# EasyEDA Pro project JLCEDA_AT-START-F490 V1.0.epro, schematic AT-START-F490 V1.0

## Sheets
1 AT_Link_EZ: Board Name: AT-START-F490 V1.0; Create Date: 2024-11-26; Page Name: AT_Link_EZ; Project Name: AT-START-F490; Schematic Name: AT-START-F490; Update Date: 2024-11-26; Company: Artery Technology; Drawed: SD; Page Size: A4; Version: 1.4
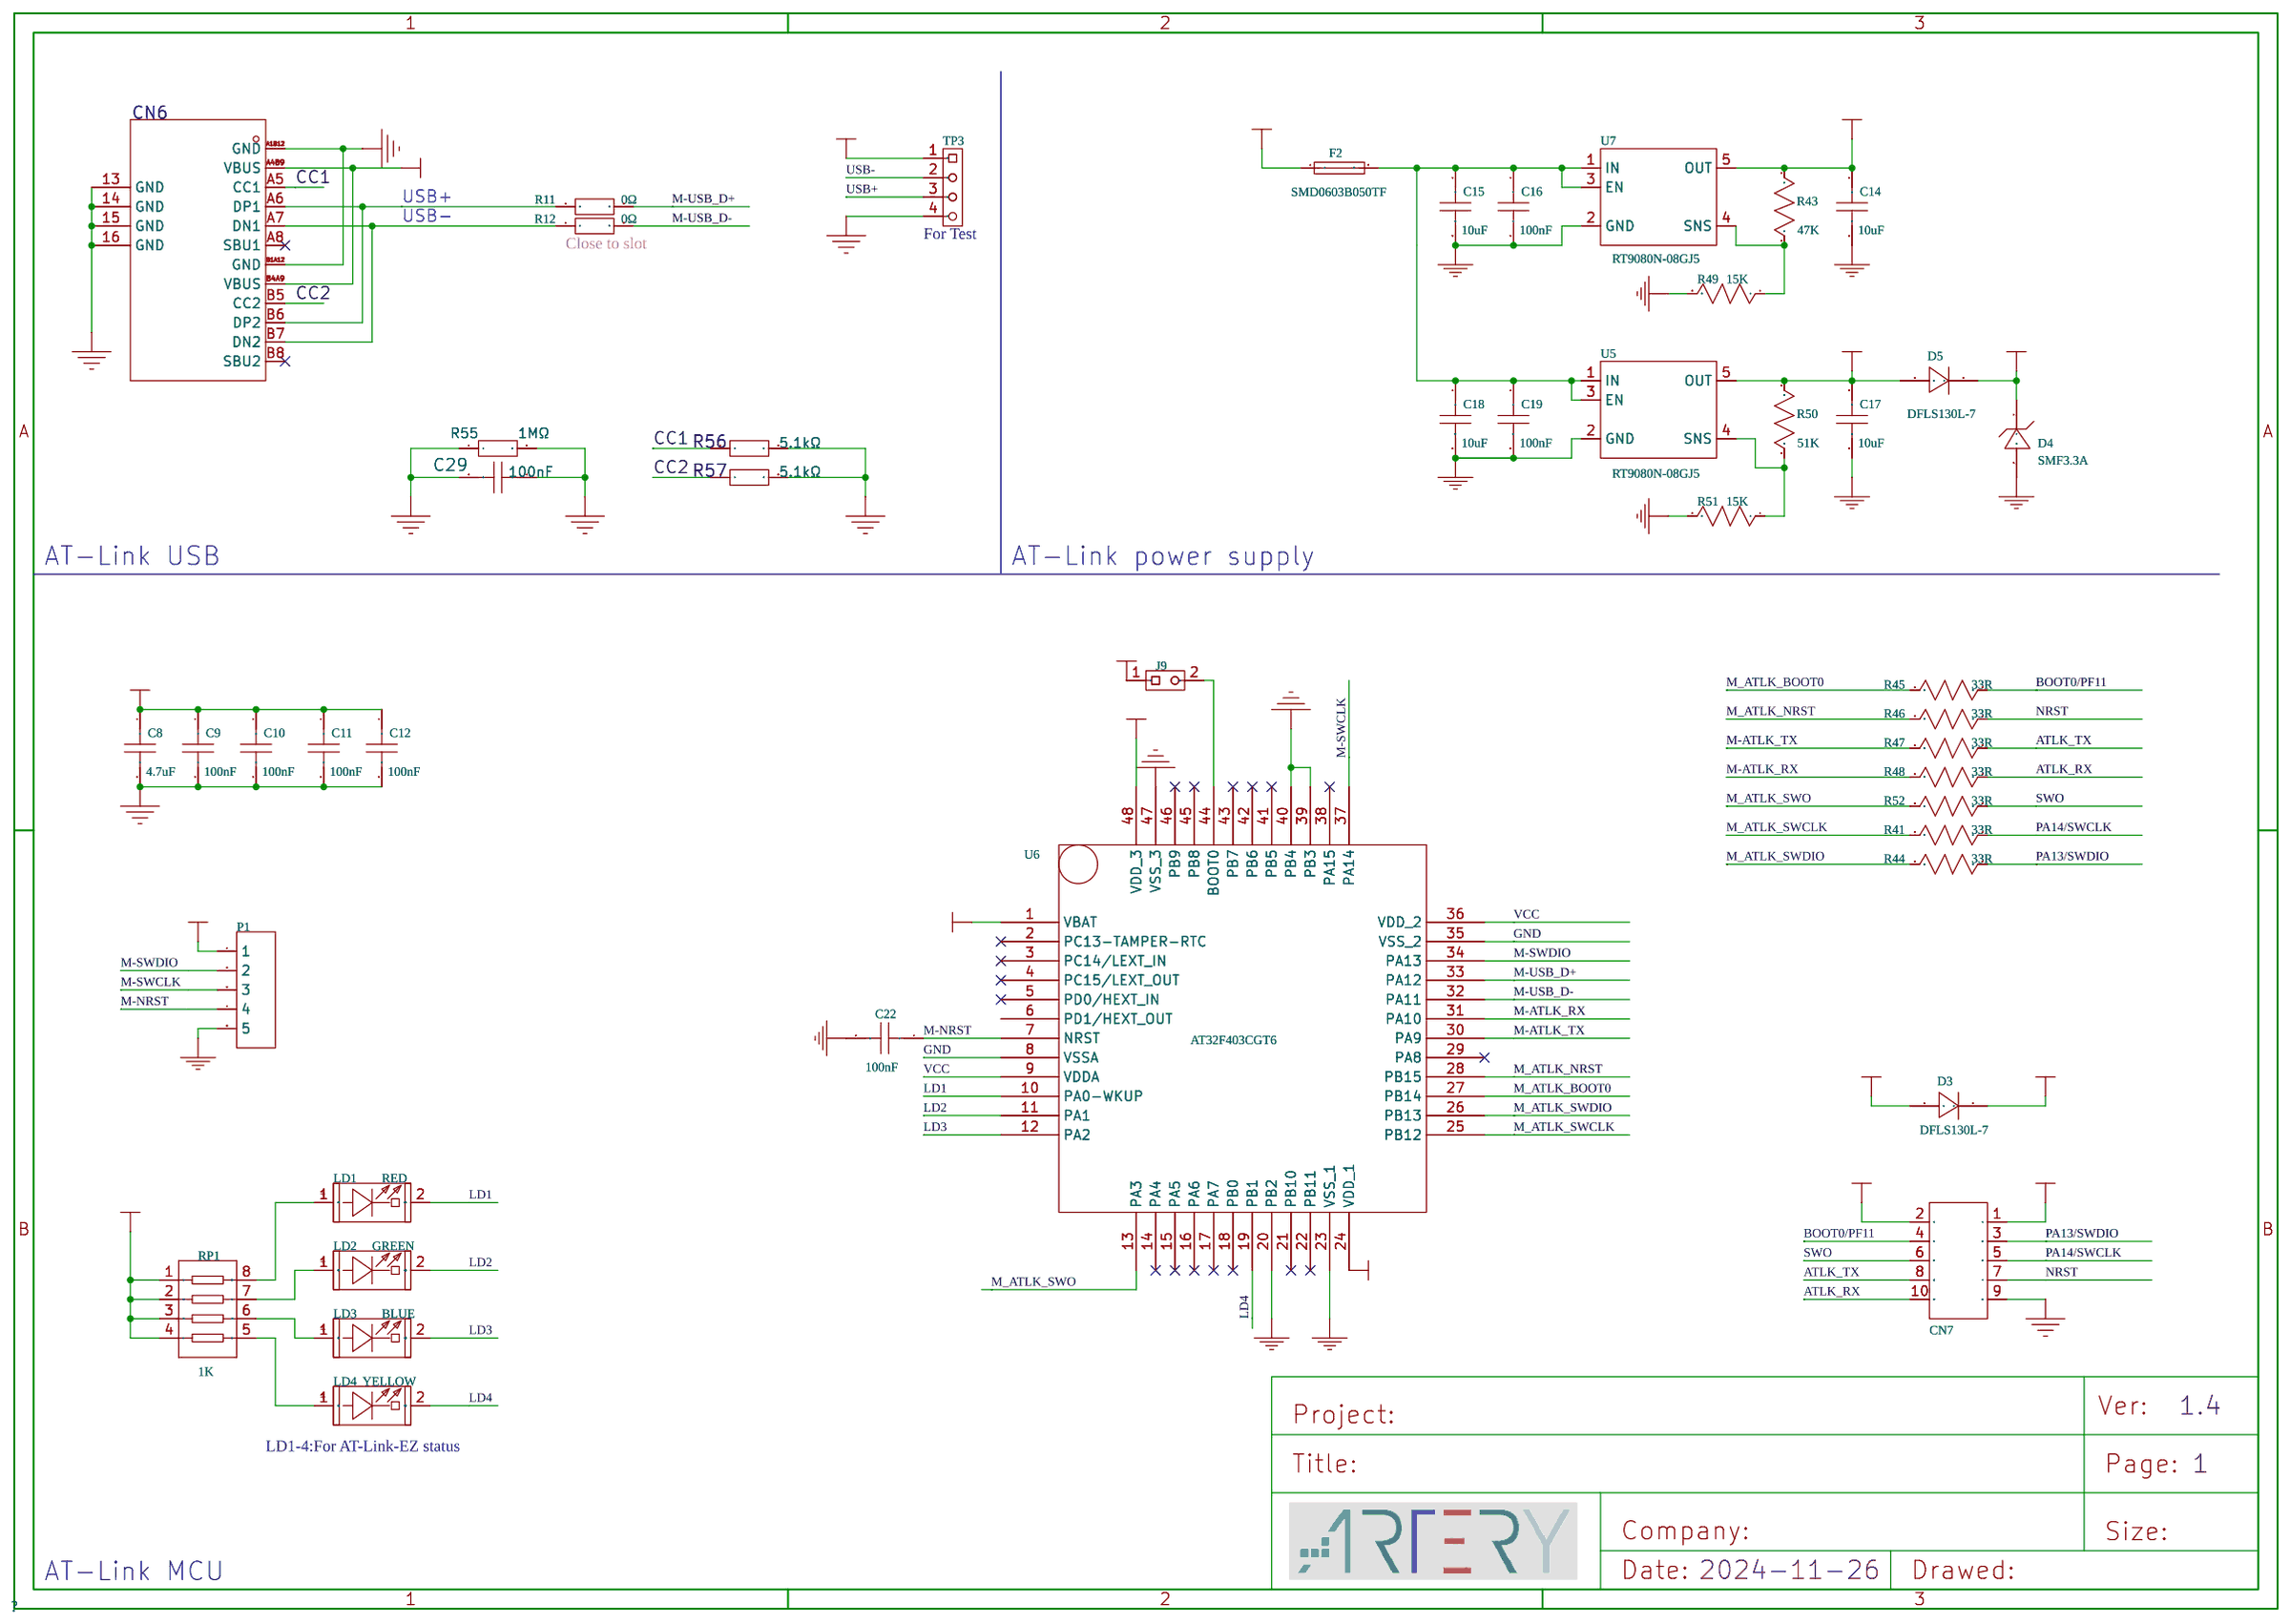
[diagram p0: AT_Link_EZ]
2 Power & Peripherals: Page Name: Power & Peripherals; Version: 1.0
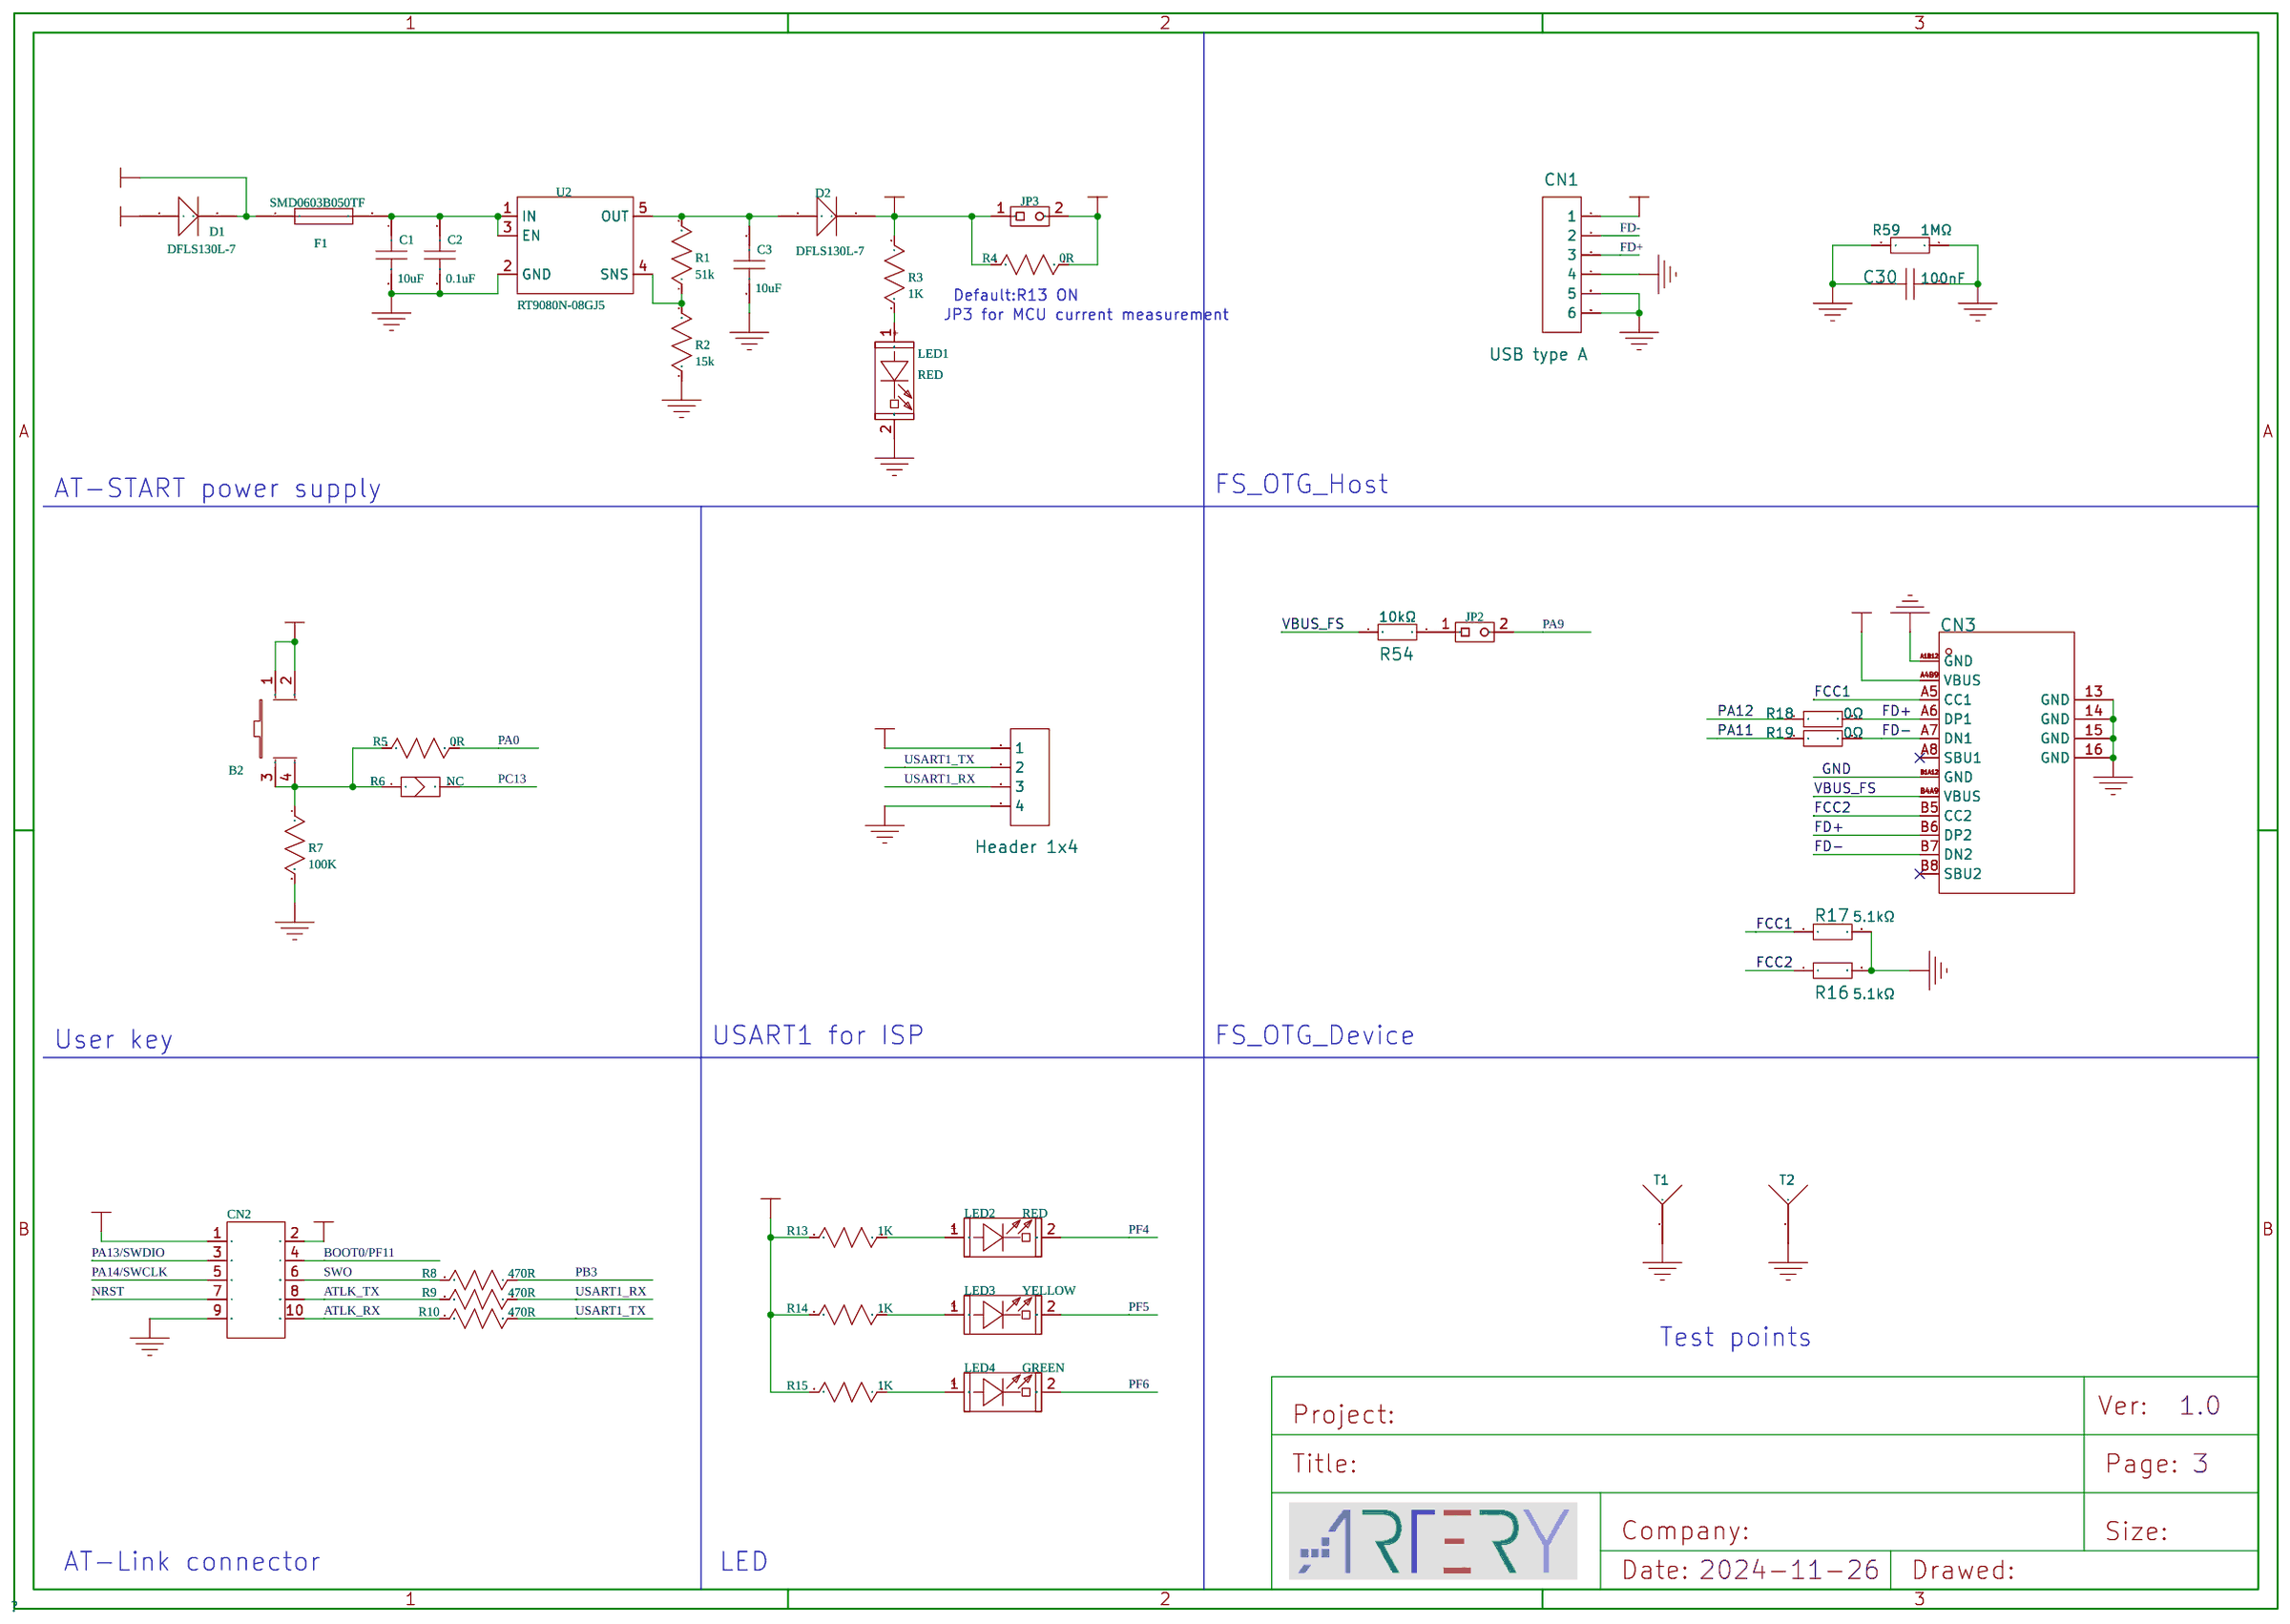
[diagram p1: Power & Peripherals]
3 Connectors: Page Name: Connectors; Version: 1.0
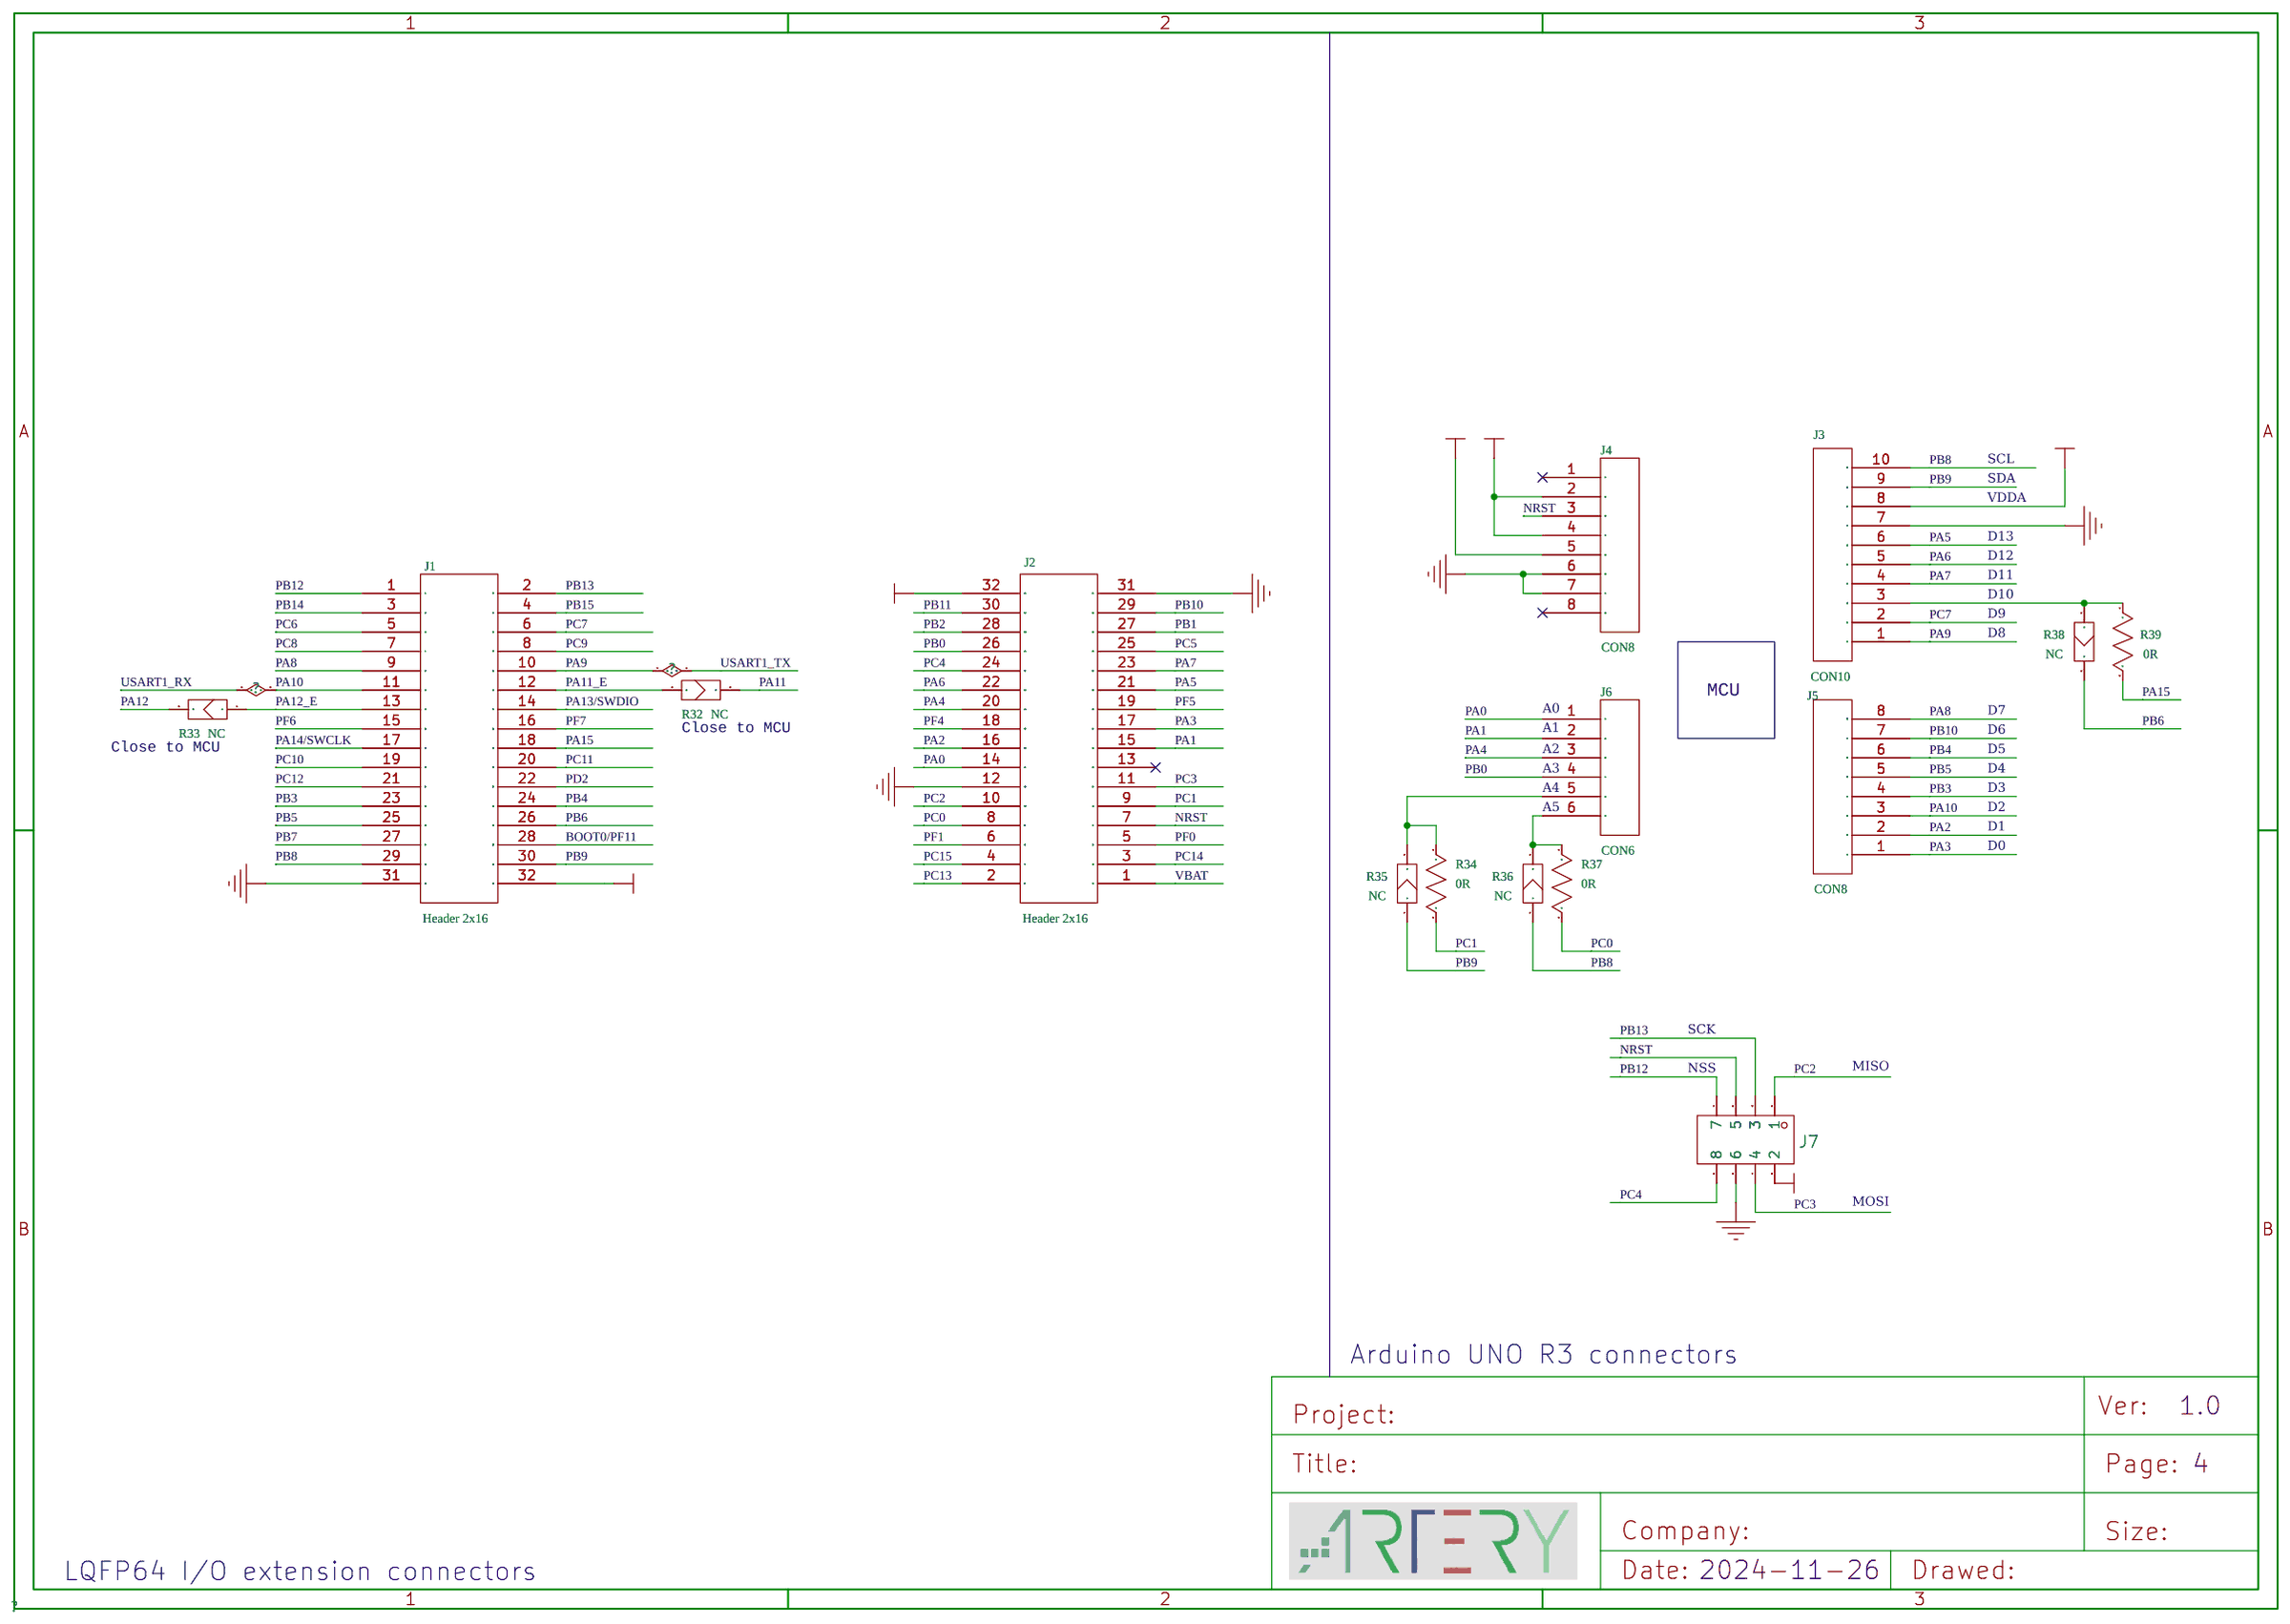
[diagram p2: Connectors]
4 MCU: Page Name: MCU; Version: 1.0
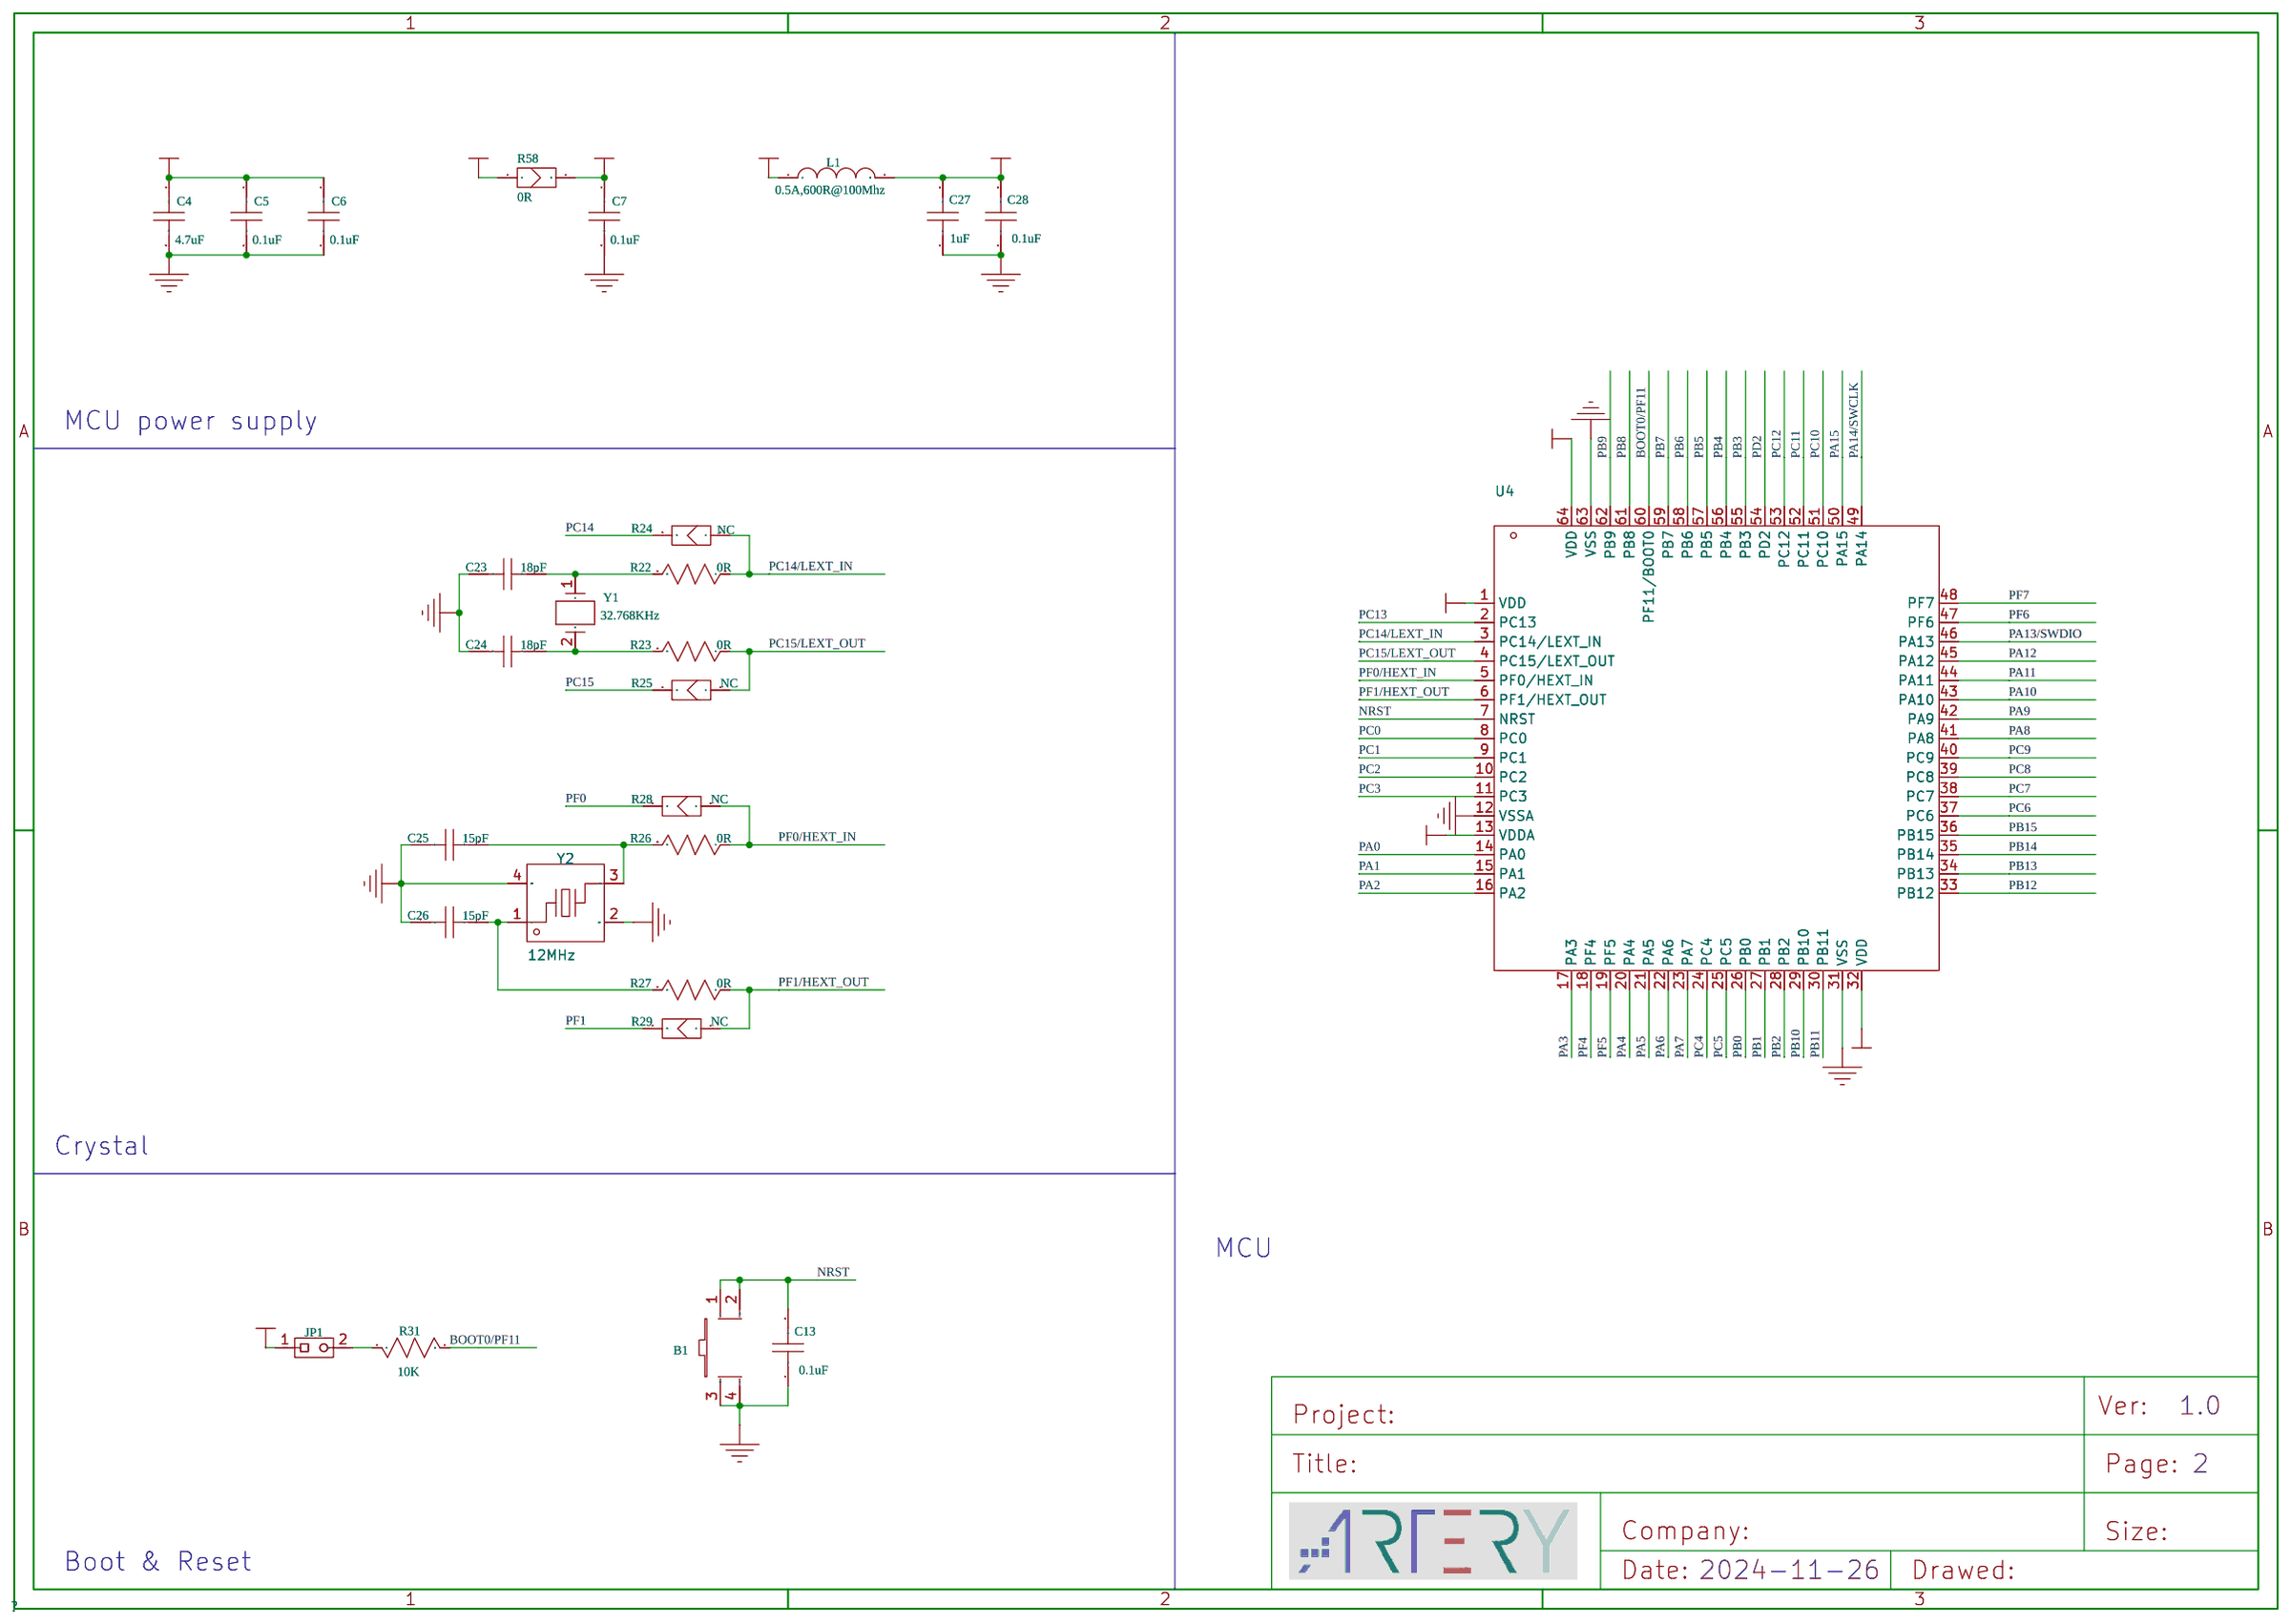
[diagram p3: MCU]

## Parts
sheet AT_Link_EZ
C8  4.7uF  [C0603]
C9  100nF  [C0603]
C10  100nF  [C0603]
C11  100nF  [C0603]
C12  100nF  [C0603]
C14  10uF  [C0603]
C15  10uF  [C0603]
C16  100nF  [C0603]
C17  10uF  [C0603]
C18  10uF  [C0603]
C19  100nF  [C0603]
C22  100nF  [C0603]
C29  100nF  [C0603]
CN6  -  [USB-C-SMD_TYPEC-304-BCP16]
CN7  CON1  [HDR2X5]
D3  DFLS130L-7  [POWERDI-123_L2.8-W1.8-LS3.7-RD]
D4  SMF3.3A  [SOD-123_L2.8-W1.8-LS3.7-RD]
D5  DFLS130L-7  [POWERDI-123_L2.8-W1.8-LS3.7-RD]
F2  SMD0603B050TF  [R0603]
J9  1X2P,Male,DIP_2.54  [HDR1X2]
LD1  RED  [LED0603]
LD2  GREEN  [LED0603]
LD3  BLUE  [LED0603]
LD4  YELLOW  [LED0603]
P1  HDR-M-2.54_1x5  [HDR-M-2.54_1X5]
R11  0Ω  [R0603]
R12  0Ω  [R0603]
R41  33R  [0603_R-M]
R43  47K  [0603_R-M]
R44  33R  [0603_R-M]
R45  33R  [0603_R-M]
R46  33R  [0603_R-M]
R47  33R  [0603_R-M]
R48  33R  [0603_R-M]
R49  15K  [0603_R-M]
R50  51K  [0603_R-M]
R51  15K  [0603_R-M]
R52  33R  [0603_R-M]
R55  1MΩ  [R0603]
R56  5.1kΩ  [R0603]
R57  5.1kΩ  [R0603]
RP1  1K  [0603*4,8P4R]
TP3  1X4P_2.54F  [HDR1X4 - TOP]
U5  RT9080N-08GJ5  [SOT-23-5]
U6  AT32F403CGT6  [LQFP48 - 2]
U7  RT9080N-08GJ5  [SOT-23-5]
sheet Connectors
J1  Header 2x16  [HDR-M-2.54_2X16]
J2  Header 2x16  [HDR-M-2.54_2X16]
J3  CON10  [FEMALE HEADER 1X10]
J4  CON8  [FEMALE HEADER 1X8]
J5  CON8  [FEMALE HEADER 1X8]
J6  CON6  [FEMALE HEADER 1X6]
J7  Header 4X2  [HDR2X4]
R32  NC  [SB-PAD]
R33  NC  [SB-PAD]
R34  0R  [SB-PAD]
R35  NC  [SB-PAD]
R36  NC  [SB-PAD]
R37  0R  [SB-PAD]
R38  NC  [SB-PAD]
R39  0R  [SB-PAD]
sheet MCU
B1  BUTTON_SMT,6.0x6.0x4.5mm  [BUTTON_SMT_6*6*5]
C4  4.7uF  [0603_C-M]
C5  0.1uF  [0603_C-M]
C6  0.1uF  [0603_C-M]
C7  0.1uF  [0603_C-M]
C13  0.1uF  [0603_C-M]
C23  18pF  [0603_C-M]
C24  18pF  [0603_C-M]
C25  15pF  [0603_C-M]
C26  15pF  [0603_C-M]
C27  1uF  [0603_C-M]
C28  0.1uF  [0603_C-M]
JP1  NC(Header 1x2)  [HEADER 1X2]
L1  0.5A,600R@100Mhz  [0603_L]
R22  0R  [0603_R-M]
R23  0R  [0603_R-M]
R24  NC  [SB-PAD]
R25  NC  [SB-PAD]
R26  0R  [0603_R-M]
R27  0R  [0603_R-M]
R28  NC  [SB-PAD]
R29  NC  [SB-PAD]
R31  10K  [0603_R-M]
R58  0R  [SB-PAD]
U4  -  [lqfp-64_l10.0-w10.0-p0.50-ls12.0-bl]
Y1  32.768KHz  [XTAL_SOP - FC-12M]
Y2  12MHz  [CRYSTAL-SMD_4P-L3.2-W2.5-BL]
sheet Power & Peripherals
B2  BUTTON_SMT,6.0x6.0x4.5mm  [BUTTON_SMT_6*6*5]
C1  10uF  [0603_C-M]
C2  0.1uF  [0603_C-M]
C3  10uF  [0603_C-M]
C30  100nF  [C0603]
CN1  USB type A  [USB-A-TH__USB-AF-90]
CN2  NC(Header 2x5)  [HDR2X5]
CN3  -  [USB-C-SMD_TYPEC-304-BCP16]
D1  DFLS130L-7  [SOD-123]
D2  DFLS130L-7  [SOD-123]
F1  SMD0603B050TF  [R0603]
J8  Header 1x4  [HDR1X4]
JP2  NC(Header 1x2)  [HEADER 1X2]
JP3  NC(Header 1x2)  [HEADER 1X2]
LED1  RED  [LED0603]
LED2  RED  [LED0603]
LED3  YELLOW  [LED0603]
LED4  GREEN  [LED0603]
R1  51k  [0603_R-M]
R2  15k  [0603_R-M]
R3  1K  [0603_R-M]
R4  0R  [0603_R-M]
R5  0R  [0603_R-M]
R6  NC  [SB-PAD]
R7  100K  [0603_R-M]
R8  470R  [0603_R-M]
R9  470R  [0603_R-M]
R10  470R  [0603_R-M]
R13  1K  [0603_R-M]
R14  1K  [0603_R-M]
R15  1K  [0603_R-M]
R16  5.1kΩ  [R0603]
R17  5.1kΩ  [R0603]
R18  0Ω  [R0603]
R19  0Ω  [R0603]
R54  10kΩ  [R0603]
R59  1MΩ  [R0603]
T1  Testpoint  [TESTHOOK]
T2  Testpoint  [TESTHOOK]
U2  RT9080N-08GJ5  [SOT-23-5]

## Library data of the parts
C4 C8 = 4.7uF
C9-C12 C16 C19 C22 = CC0603KRX7R9BB104: 容值:100nF;精度:±10%;额定电压:50V;材质(温度系数):X7R;; LCSC Part Name: 100nF ±10% 50V; Supplier Part: C14663; Manufacturer: YAGEO(国巨); Supplier Footprint: 0603; JLCPCB Part Class: Basic Part; Datasheet: https://atta.szlcsc.com/upload/public/pdf/source/20180910/C282072_33301C7F631E79921B82A8DAC6BCC5B3.pdf; Supplier: LCSC; Tolerance: ±10%; Voltage Rated: 50V; Temperature Coefficient: X7R
C14 C15 C17 C18 = CL10A106KP8NNNC: 容值:10uF;精度:±10%;额定电压:10V;材质(温度系数):X5R;; LCSC Part Name: 10uF ±10% 10V; Supplier Part: C19702; Manufacturer: SAMSUNG(三星); Supplier Footprint: 0603; JLCPCB Part Class: Basic Part; Datasheet: https://atta.szlcsc.com/upload/public/pdf/source/20160103/1457707703378.pdf; Supplier: LCSC; Tolerance: ±10%; Voltage Rated: 10V; Temperature Coefficient: X5R
C29 C30 = CC0603KRX7R9BB104: 容值:100nF;精度:±10%;额定电压:50V;温度系数:X7R;; LCSC Part Name: 100nF ±10% 50V; Supplier Part: C14663; Manufacturer: YAGEO(国巨); Supplier Footprint: 0603; JLCPCB Part Class: Basic Part; Datasheet: https://atta.szlcsc.com/upload/public/pdf/source/20170116/1484561234239.pdf; Supplier: LCSC; Tolerance: ±10%; Voltage Rated: 50V; Temperature Coefficient: X7R
CN3 CN6 = TYPEC-304-BCP16: 连接器类型:Type-C;标准:USB 3.1;公母:母座;触点数量:16.0;端口数量:1;安装方式:卧贴;额定电流 - 电源:3A;工作温度范围:-25~+85;焊接温度(最大值):260;; Supplier Part: C720629; Manufacturer: XUNPU(讯普); Supplier Footprint: SMD; JLCPCB Part Class: Extended Part; Datasheet: https://atta.szlcsc.com/upload/public/pdf/source/20211022/DACD6552F639E9483017DE6DC0E61150.pdf; Supplier: LCSC; Connector Type: Type-C; Standard: USB 3.1; Gender: 母座; Number of Contacts: 16.0; Number of Ports: 1; Mounting Sytle: 卧贴; Current Rating - Power (Max): 3A; Operating Temperature Range: -25~+85; Welding Temperature (Max): 260
CN7 = CON1
D3 D5 = DFLS130L-7: Supplier: LCSC; Supplier Part: C110493; Manufacturer: Diodes Incorporated; Paste Type: expand
D4 = SMF3.3A: Supplier: LCSC; Supplier Part: C283866; Manufacturer: DOWO; Paste Type: expand
F2 = SMD0603B035TF: Supplier: LCSC; Supplier Part: C269154; Manufacturer: Brightking Elec (TAIWAN); Paste Type: expand
J9 = 1X2P,Male,DIP_2.54
LD1 LED1 LED2 = RED
LD2 LED4 = GREEN
LD3 = BLUE
LD4 LED3 = YELLOW
P1 = HDR-M-2.54_1x5: Supplier Part: C358687; Supplier: LCSC
R11 R12 = 0603WAF0000T5E: 电阻类型:厚膜电阻;阻值:0Ω;精度:±1%;功率:100mW;; LCSC Part Name: 0Ω ±1% 100mW; Supplier Part: C21189; Manufacturer: UNI-ROYAL(厚声); Supplier Footprint: 0603; JLCPCB Part Class: Basic Part; Datasheet: https://atta.szlcsc.com/upload/public/pdf/source/20200306/C422600_1E6D84923E4A46A82E41ADD87F860B5C.pdf; Supplier: LCSC; Type: 厚膜电阻; Tolerance: ±1%; Power(Watts): 100mW; Overload Voltage (Max): 75V; Operating Temperature Range: -55℃~+155℃
R41 R44-R48 R52 = 33R
R43 = 47K
R49 R51 = 15K
R50 = 51K
R55 R59 = RC0603FR-071ML: 阻值:1MΩ;精度:±1%;功率:100mW;温度系数:±100ppm/;最大工作电压:75V;工作温度范围:-55~+155;; LCSC Part Name: 1MΩ ±1%; Supplier Part: C105578; Manufacturer: YAGEO(国巨); Supplier Footprint: 0603; JLCPCB Part Class: Extended Part; Datasheet: https://atta.szlcsc.com/upload/public/pdf/source/20181102/C105578_67A9388250AF143DE4682E62257D2969.pdf; Supplier: LCSC; Tolerance: ±1%; Power(Watts): 100mW; Temperature Coefficient: ±100ppm/; Overload Voltage (Max): 75V; Operating Temperature Range: -55~+155
R16 R17 R56 R57 = 0603WAF5101T5E: 电阻类型:厚膜电阻;阻值:5.1kΩ;精度:±1%;功率:1/10W;温度系数:±100ppm/;最大工作电压:75V;工作温度范围:-55~+155;; LCSC Part Name: 5.1kΩ ±1%; Supplier Part: C23186; Manufacturer: UNI-ROYAL(厚声); Supplier Footprint: 0603; JLCPCB Part Class: Basic Part; Datasheet: https://atta.szlcsc.com/upload/public/pdf/source/20200306/C422600_1E6D84923E4A46A82E41ADD87F860B5C.pdf; Supplier: LCSC; Type: 厚膜电阻; Tolerance: ±1%; Power(Watts): 1/10W; Temperature Coefficient: ±100ppm/; Overload Voltage (Max): 75V; Operating Temperature Range: -55~+155
RP1 = 1K: Comment: 33R
TP3 = 1X4P_2.54F
U2 U5 U7 = RT9080N-08GJ5
U6 = AT32F403CGT6
J1 J2 = Header 2x16
J3 = CON10
J4 J5 = CON8
J6 = CON6
J7 = Header 4X2: LatestRevisionDate: 17-Jul-2002; LatestRevisionNote: Re-released for DXP Platform.; Publisher: Altium Limited
R6 R24 R25 R28 R29 R32 R33 R35 R36 R38 R58 = NC
R4 R5 R22 R23 R26 R27 R34 R37 R39 = 0R
B1 B2 = BUTTON_SMT,6.0x6.0x4.5mm
C2 C5-C7 C13 C28 = 0.1uF
C23 C24 = 10pF
C25 C26 = 22pF
C27 = 1uF
JP1-JP3 = NC(Header 1x2)
L1 = 0.5A,600R@100Mhz
R31 = 10K
U4 = AT32F490RxT7: 由官方提供; Manufacturer: Artery Technology
Y1 = 32.768KHz
Y2 = CJ13-120001210B20: 频率:12MHz;负载电容:12pF;; LCSC Part Name: 12MHz 12pF; Supplier Part: C2875246; Manufacturer: CJ(江苏长电/长晶); Supplier Footprint: SMD3225-4P; JLCPCB Part Class: 扩展库; Datasheet: https://atta.szlcsc.com/upload/public/pdf/source/20210824/E6873A29EC9F0F4D38BC5C84A85B05C9.pdf; Supplier: LCSC; Load Capacitance: 12pF
C1 C3 = 10uF
CN1 = USB type A: Supplier Part: C40877; Supplier: LCSC
CN2 = NC(Header 2x5)
D1 D2 = DFLS130L-7: Published: 8-Jun-2000; LatestRevisionDate: 17-Jul-2002; LatestRevisionNote: Re-released for DXP Platform.; PackageVersion: Sep-1996; PackageReference: SMC; Publisher: Altium Limited; PackageDescription: DO-214-AB/SMC; 2 C-Bend Leads; Body 7.9 x 5.9 mm, inc. leads (LxW); Code_JEDEC: DO-214-AB
F1 = SMD0603B050TF: Published: 8-Jun-2000; LatestRevisionDate: 17-Jul-2002; LatestRevisionNote: Re-released for DXP Platform.; PackageReference: PIN-W2/E2.8; Publisher: Altium Limited; PackageDescription: Thru-Hole; 2 Leads
J8 = Header 1x4: Supplier Part: C124378; Supplier: LCSC
R1 = 51k
R2 = 15k
R3 R13-R15 = 1K
R7 = 100K
R8-R10 = 470R
R18 R19 = 0603WAF220JT5E: 电阻类型:厚膜电阻;阻值:22Ω;精度:±1%;功率:100mW;温度系数:±100ppm/;最大工作电压:75V;工作温度范围:-55~+155;; LCSC Part Name: 22Ω ±1% 100mW; Supplier Part: C23345; Manufacturer: UNI-ROYAL(厚声); Supplier Footprint: 0603; JLCPCB Part Class: 基础库; Datasheet: https://atta.szlcsc.com/upload/public/pdf/source/20200306/C422600_1E6D84923E4A46A82E41ADD87F860B5C.pdf; Supplier: LCSC; Type: 厚膜电阻; Tolerance: ±1%; Power(Watts): 100mW; Temperature Coefficient: ±100ppm/; Overload Voltage (Max): 75V; Operating Temperature Range: -55~+155
R54 = 0603WAF1002T5E: 电阻类型:厚膜电阻;阻值:10kΩ;精度:±1%;功率:1/10W;温度系数:±100ppm/;最大工作电压:75V;工作温度范围:-55~+155;; LCSC Part Name: 10kΩ ±1%; Supplier Part: C25804; Manufacturer: UNI-ROYAL(厚声); Supplier Footprint: 0603; JLCPCB Part Class: Basic Part; Datasheet: https://atta.szlcsc.com/upload/public/pdf/source/20200306/C422600_1E6D84923E4A46A82E41ADD87F860B5C.pdf; Supplier: LCSC; Type: 厚膜电阻; Tolerance: ±1%; Power(Watts): 1/10W; Temperature Coefficient: ±100ppm/; Overload Voltage (Max): 75V; Operating Temperature Range: -55~+155
T1 T2 = Testpoint: LatestRevisionDate: 17-Jul-2002; LatestRevisionNote: Re-released for DXP Platform.; Publisher: Altium Limited

## Nets
3V3: CN2.1 CN7.1 D2.2(K) D4.1 D5.1 J4.2 J4.4 J8.1 JP3.1 R3.1 R4.2 R13.2 R14.2 R15.2
5V: CN1.1 CN2.2 CN7.2 D1.2(K) D3.1 F1.1 J4.5 J7.2
GND: B1.3 B1.4 C1.2 C2.2 C3.2 C4.2 C5.2 C6.2 C7.2 C8.2 C9.2 C10.2 C11.2 C12.2 C13.1 C14.2 C15.2 C16.2 C17.2 C18.2 C19.2 C22.2 C23.1 C24.1 C25.1 C26.1 C27.1 C28.1 C29.1 C30.1 CN1.4 CN2.9 CN3.A1B12(GND) CN3.B1A12(GND) CN6.A1B12(GND) CN6.B1A12(GND) CN7.9 D4.2 J1.31 J2.12 J2.31 J3.7 J4.6 J4.7 J7.6 J8.4 LED1.2(CATHODE) P1.5 R2.1 R7.2 R16.2 R17.2 R49.2 R51.2 R55.2 R56.2 R57.2 R59.2 T1.1 T2.1 TP3.4 U2.2(GND) U4.12(VSSA) U4.31(VSS) U4.63(VSS) U5.2(GND) U6.8(VSSA) U6.20(PB2) U6.23(VSS_1) U6.35(VSS_2) U6.39(PB3) U6.40(PB4) U6.47(VSS_3) U7.2(GND) Y2.2(GND) Y2.4(GND)
VBAT: J2.1
VBUS_FS: CN3.A4B9(VBUS) CN3.B4A9(VBUS) D1.1(A) R54.2
VCC: C8.1 C9.1 C10.1 C11.1 C12.1 C14.1 J9.1 P1.1 R43.2 RP1.1 RP1.2 RP1.3 RP1.4 U6.1(VBAT) U6.9(VDDA) U6.24(VDD_1) U6.36(VDD_2) U6.48(VDD_3) U7.5(OUT)
VCC3.5V: C17.1 D5.2 R50.2 U5.5(OUT)
VDD: B2.1 B2.2 C4.1 C5.1 C6.1 C7.1 J1.32 J2.32 JP1.1 JP3.2 L1.1 R4.1 R58.1 R58.2 U4.1(VDD) U4.32(VDD) U4.64(VDD)
VDDA: C27.2 C28.2 J3.8 L1.2 U4.13(VDDA)
ATLINK_5V: CN6.A4B9(VBUS) CN6.B4A9(VBUS) D3.2 F2.1 TP3.1
ATLK_RX: CN2.10 CN7.10 R10.2 R48.1
ATLK_TX: CN2.8 CN7.8 R9.2 R47.1
BOOT0/PF11: CN2.4 CN7.4 J1.28 R31.2 R45.1 U4.60(PF11/BOOT0)
CC1: CN6.A5(CC1) R56.1
CC2: CN6.B5(CC2) R57.1
EGND: C30.2 CN1.SH1(5) CN1.SH2(6) CN3.13(GND) CN3.14(GND) CN3.15(GND) CN3.16(GND) R59.1
EGND2: C29.2 CN6.13(GND) CN6.14(GND) CN6.15(GND) CN6.16(GND) R55.1
FCC1: CN3.A5(CC1) R17.1
FCC2: CN3.B5(CC2) R16.1
FD+: CN1.3 CN3.A6(DP1) CN3.B6(DP2) R18.2
FD-: CN1.2 CN3.A7(DN1) CN3.B7(DN2) R19.2
LD1: LD1.2(CATHODE) U6.10(PA0-WKUP)
LD2: LD2.2(CATHODE) U6.11(PA1)
LD3: LD3.2(CATHODE) U6.12(PA2)
LD4: LD4.2(CATHODE) U6.19(PB1)
M-ATLK_RX: R48.2 U6.31(PA10)
M-ATLK_TX: R47.2 U6.30(PA9)
M-NRST: C22.1 P1.4 U6.7(NRST)
M-SWCLK: P1.3 U6.37(PA14)
M-SWDIO: P1.2 U6.34(PA13)
M-USB_D+: R11.2 U6.33(PA12)
M-USB_D-: R12.2 U6.32(PA11)
M_ATLK_BOOT0: R45.2 U6.27(PB14)
M_ATLK_NRST: R46.2 U6.28(PB15)
M_ATLK_SWCLK: R41.2 U6.25(PB12)
M_ATLK_SWDIO: R44.2 U6.26(PB13)
M_ATLK_SWO: R52.2 U6.13(PA3)
NRST: B1.1 B1.2 C13.2 CN2.7 CN7.7 J2.7 J4.3 J7.5 R46.1 U4.7(NRST)
PA0: J2.14 J6.1 R5.1 U4.14(PA0)
PA1: J2.15 J6.2 U4.15(PA1)
PA2: J2.16 J5.2 U4.16(PA2)
PA3: J2.17 J5.1 U4.17(PA3)
PA4: J2.20 J6.3 U4.20(PA4)
PA5: J2.21 J3.6 U4.21(PA5)
PA6: J2.22 J3.5 U4.22(PA6)
PA7: J2.23 J3.4 U4.23(PA7)
PA8: J1.9 J5.8 U4.41(PA8)
PA9: J1.10 J3.1 J8.2 JP2.2 R10.1 U4.42(PA9)
PA10: J1.11 J5.3 J8.3 R9.1 U4.43(PA10)
PA11: R19.1 R32.2 U4.44(PA11)
PA11_E: J1.12 R32.1
PA12: R18.1 R33.2 U4.45(PA12)
PA12_E: J1.13 R33.1
PA13/SWDIO: CN2.3 CN7.3 J1.14 R44.1 U4.46(PA13)
PA14/SWCLK: CN2.5 CN7.5 J1.17 R41.1 U4.49(PA14)
PA15: J1.18 R39.2 U4.50(PA15)
PB0: J2.26 J6.4 U4.26(PB0)
PB1: J2.27 U4.27(PB1)
PB2: J2.28 U4.28(PB2)
PB3: J1.23 J5.4 R8.1 U4.55(PB3)
PB4: J1.24 J5.6 U4.56(PB4)
PB5: J1.25 J5.5 U4.57(PB5)
PB6: J1.26 R38.2 U4.58(PB6)
PB7: J1.27 U4.59(PB7)
PB8: J1.29 J3.10 R36.1 U4.61(PB8)
PB9: J1.30 J3.9 R35.1 U4.62(PB9)
PB10: J2.29 J5.7 U4.29(PB10)
PB11: J2.30 U4.30(PB11)
PB12: J1.1 J7.7 U4.33(PB12)
PB13: J1.2 J7.3 U4.34(PB13)
PB14: J1.3 U4.35(PB14)
PB15: J1.4 U4.36(PB15)
PC0: J2.8 R37.1 U4.8(PC0)
PC1: J2.9 R34.1 U4.9(PC1)
PC2: J2.10 J7.1 U4.10(PC2)
PC3: J2.11 J7.4 U4.11(PC3)
PC4: J2.24 J7.8 U4.24(PC4)
PC5: J2.25 U4.25(PC5)
PC6: J1.5 U4.37(PC6)
PC7: J1.6 J3.2 U4.38(PC7)
PC8: J1.7 U4.39(PC8)
PC9: J1.8 U4.40(PC9)
PC10: J1.19 U4.51(PC10)
PC11: J1.20 U4.52(PC11)
PC12: J1.21 U4.53(PC12)
PC13: J2.2 R6.2 U4.2(PC13)
PC14: J2.3 R24.2
PC14/LEXT_IN: R22.1 R24.1 U4.3(PC14/LEXT_IN)
PC15: J2.4 R25.2
PC15/LEXT_OUT: R23.1 R25.1 U4.4(PC15/LEXT_OUT)
PD2: J1.22 U4.54(PD2)
PF0: J2.5 R28.2
PF0/HEXT_IN: R26.1 R28.1 U4.5(PF0/HEXT_IN)
PF1: J2.6 R29.2
PF1/HEXT_OUT: R27.1 R29.1 U4.6(PF1/HEXT_OUT)
PF4: J2.18 LED2.2(CATHODE) U4.18(PF4)
PF5: J2.19 LED3.2(CATHODE) U4.19(PF5)
PF6: J1.15 LED4.2(CATHODE) U4.47(PF6)
PF7: J1.16 U4.48(PF7)
SWO: CN2.6 CN7.6 R8.2 R52.1
USB+: CN6.A6(DP1) CN6.B6(DP2) R11.1 TP3.3
USB-: CN6.A7(DN1) CN6.B7(DN2) R12.1 TP3.2
$1N307: J9.2 U6.44(BOOT0)
$1N334: LD4.1(ANODE) RP1.5
$1N335: LD3.1(ANODE) RP1.6
$1N336: LD2.1(ANODE) RP1.7
$1N337: LD1.1(ANODE) RP1.8
$1N361: C15.1 C16.1 C18.1 C19.1 F2.2 U5.1(IN) U5.3(EN) U7.1(IN) U7.3(EN)
$1N396: R50.1 R51.1 U5.4(SNS)
$1N467: R43.1 R49.1 U7.4(SNS)
$2N290: C3.1 D2.1(A) R1.2 U2.5(OUT)
$2N291: R1.1 R2.2 U2.4(SNS)
$2N326: LED1.1(ANODE) R3.2
$2N337: C1.1 C2.1 F1.2 U2.1(IN) U2.3(EN)
$2N360: B2.3 B2.4 R5.2 R6.1 R7.1
$2N488: LED3.1(ANODE) R14.1
$2N489: LED2.1(ANODE) R13.1
$2N490: LED4.1(ANODE) R15.1
$2N12490: JP2.1 R54.1
$3N199: J6.5 R34.2 R35.2
$3N200: J6.6 R36.2 R37.2
$3N264: J3.3 R38.1 R39.1
$4N238: C25.2 R26.2 Y2.3
$4N239: C26.2 R27.2 Y2.1
$4N333: C24.2 R23.2 Y1.2
$4N335: C23.2 R22.2 Y1.1
$4N462: JP1.2 R31.1

Not connected (* = marked no-connect by the designer): CN3 A8(SBU1)* B8(SBU2)*; CN6 A8(SBU1)* B8(SBU2)*; J2 13*; J4 1* 8*; U6 2(PC13-TAMPER-RTC)* 3(PC14/LEXT_IN)* 4(PC15/LEXT_OUT)* 5(PD0/HEXT_IN)* 6(PD1/HEXT_OUT) 14(PA4)* 15(PA5)* 16(PA6)* 17(PA7)* 18(PB0)* 21(PB10)* 22(PB11)* 29(PA8)* 38(PA15)* 41(PB5)* 42(PB6)* 43(PB7)* 45(PB8)* 46(PB9)*

## Notes on the sheets
sheet 1
- For Test
- Close to slot
- AT-Link USB
- AT-Link power supply
- LD1-4:For AT-Link-EZ status
- AT-Link MCU
sheet 2
- Default:R13 ON
- JP3 for MCU current measurement
- AT-START power supply
- FS_OTG_Host
- User key
- USART1 for ISP
- FS_OTG_Device
- Test points
- AT-Link connector
- LED
sheet 3
- SCL
- SDA
- VDDA
- D13
- D12
- D11
- D10
- D9
- D8
- MCU
- A0
- D7
- Close to MCU
- A1
- D6
- Close to MCU
- A2
- A3
- D4
- D5
- A4
- D3
- A5
- D2
- D1
- D0
- SCK
- MISO
- NSS
- MOSI
- Arduino UNO R3 connectors
- LQFP64 I/O extension connectors
sheet 4
- MCU power supply
- Crystal
- MCU
- Boot & Reset
